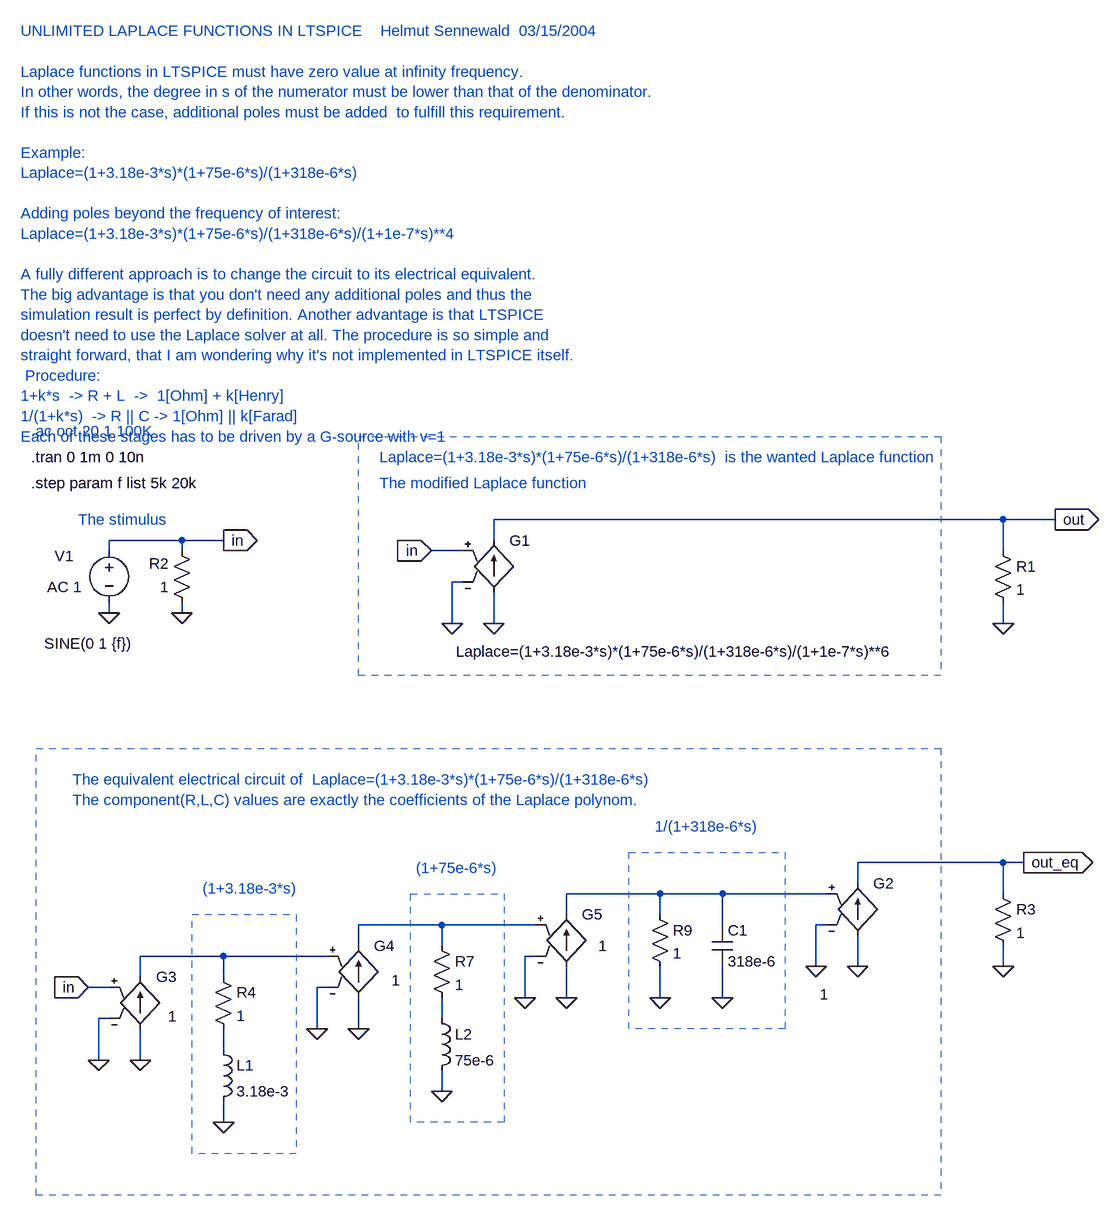
[diagram p0: schematic Laplace_unlimited.asc]
Laplace_unlimited.asc, the LTspice schematic file:
Version 4
SHEET 1 1692 1172
WIRE 448 128 448 160
WIRE 448 240 448 288
WIRE 400 224 384 224
WIRE 448 128 1232 128
WIRE 1232 128 1232 176
WIRE 384 224 384 288
WIRE 1232 256 1232 288
WIRE -32 256 -32 272
WIRE -144 256 -144 272
WIRE -144 160 -144 176
WIRE 400 176 352 176
WIRE -96 800 -96 832
WIRE -96 912 -96 960
WIRE -144 896 -160 896
WIRE -96 800 32 800
WIRE -160 896 -160 960
WIRE -144 848 -176 848
WIRE 32 832 32 800
WIRE 32 912 32 944
WIRE 32 1024 32 1056
WIRE 240 752 240 784
WIRE 240 864 240 912
WIRE 192 848 176 848
WIRE 240 752 368 752
WIRE 176 848 176 912
WIRE 192 800 32 800
WIRE 368 784 368 752
WIRE 368 864 368 896
WIRE 368 976 368 1008
WIRE 560 704 560 736
WIRE 560 816 560 864
WIRE 512 800 496 800
WIRE 560 704 704 704
WIRE 496 800 496 864
WIRE 512 752 368 752
WIRE 704 736 704 704
WIRE 704 816 704 864
WIRE 704 704 800 704
WIRE 800 704 800 752
WIRE 800 816 800 864
WIRE 1232 128 1312 128
WIRE 800 704 960 704
WIRE 1008 656 1008 688
WIRE 1008 768 1008 816
WIRE 960 752 944 752
WIRE 1008 656 1232 656
WIRE 1232 656 1232 704
WIRE 944 752 944 816
WIRE 1232 784 1232 816
WIRE 1232 656 1264 656
WIRE -32 176 -32 160
WIRE -32 160 -144 160
WIRE -32 160 32 160
FLAG 448 288 0
FLAG 384 288 0
FLAG 1232 288 0
FLAG -32 272 0
FLAG -144 272 0
FLAG 1312 128 out
IOPIN 1312 128 Out
FLAG 352 176 in
IOPIN 352 176 In
FLAG -96 960 0
FLAG -160 960 0
FLAG -176 848 in
IOPIN -176 848 In
FLAG 32 1056 0
FLAG 240 912 0
FLAG 176 912 0
FLAG 368 1008 0
FLAG 560 864 0
FLAG 496 864 0
FLAG 704 864 0
FLAG 800 864 0
FLAG 1008 816 0
FLAG 944 816 0
FLAG 1232 816 0
FLAG 1264 656 out_eq
IOPIN 1264 656 Out
FLAG 32 160 in
IOPIN 32 160 Out
SYMBOL voltage -144 160 R0
WINDOW 0 -84 24 Left 0
WINDOW 3 -100 159 Left 0
WINDOW 123 -95 72 Left 0
WINDOW 39 24 160 Left 0
SYMATTR InstName V1
SYMATTR Value SINE(0 1 {f})
SYMATTR Value2 AC 1
SYMBOL res 1216 160 R0
SYMATTR InstName R1
SYMATTR Value 1
SYMBOL res -16 272 R180
WINDOW 0 36 76 Left 0
WINDOW 3 36 40 Left 0
SYMATTR InstName R2
SYMATTR Value 1
SYMBOL g 448 144 R0
WINDOW 3 -58 187 Left 0
SYMATTR Value Laplace=(1+3.18e-3*s)*(1+75e-6*s)/(1+318e-6*s)/(1+1e-7*s)**6
SYMATTR InstName G1
SYMBOL g -96 816 R0
WINDOW 3 43 77 Left 0
SYMATTR Value 1
SYMATTR InstName G3
SYMBOL res 16 816 R0
SYMATTR InstName R4
SYMATTR Value 1
SYMBOL ind 16 928 R0
SYMATTR InstName L1
SYMATTR Value 3.18e-3
SYMBOL g 240 768 R0
WINDOW 3 51 69 Left 0
SYMATTR Value 1
SYMATTR InstName G4
SYMBOL res 352 768 R0
SYMATTR InstName R7
SYMATTR Value 1
SYMBOL ind 352 880 R0
SYMATTR InstName L2
SYMATTR Value 75e-6
SYMBOL g 560 720 R0
WINDOW 3 49 64 Left 0
SYMATTR Value 1
SYMATTR InstName G5
SYMBOL res 688 720 R0
SYMATTR InstName R9
SYMATTR Value 1
SYMBOL cap 784 752 R0
SYMATTR InstName C1
SYMATTR Value 318e-6
SYMBOL res 1216 688 R0
SYMATTR InstName R3
SYMATTR Value 1
SYMBOL g 1008 672 R0
WINDOW 3 -58 187 Left 0
SYMATTR Value 1
SYMATTR InstName G2
TEXT -264 -8 Left 0 ;.ac oct 20 1 100K
TEXT -264 32 Left 0 !.tran 0 1m 0 10n
TEXT -264 72 Left 0 !.step param f list 5k 20k
TEXT 272 32 Left 0 ;Laplace=(1+3.18e-3*s)*(1+75e-6*s)/(1+318e-6*s)  is the wanted Laplace function
TEXT -280 -624 Left 0 ;UNLIMITED LAPLACE FUNCTIONS IN LTSPICE    Helmut Sennewald  03/15/2004\n \nLaplace functions in LTSPICE must have zero value at infinity frequency.\nIn other words, the degree in s of the numerator must be lower than that of the denominator.\nIf this is not the case, additional poles must be added  to fulfill this requirement.\n \nExample:\nLaplace=(1+3.18e-3*s)*(1+75e-6*s)/(1+318e-6*s)\n \nAdding poles beyond the frequency of interest:\nLaplace=(1+3.18e-3*s)*(1+75e-6*s)/(1+318e-6*s)/(1+1e-7*s)**4\n \nA fully different approach is to change the circuit to its electrical equivalent.\nThe big advantage is that you don't need any additional poles and thus the\nsimulation result is perfect by definition. Another advantage is that LTSPICE\ndoesn't need to use the Laplace solver at all. The procedure is so simple and\nstraight forward, that I am wondering why it's not implemented in LTSPICE itself.\n Procedure:\n1+k*s  -> R + L  ->  1[Ohm] + k[Henry]\n1/(1+k*s)  -> R || C -> 1[Ohm] || k[Farad]\nEach of these stages has to be driven by a G-source with v=1
TEXT 0 696 Left 0 ;(1+3.18e-3*s)
TEXT 328 664 Left 0 ;(1+75e-6*s)
TEXT 696 600 Left 0 ;1/(1+318e-6*s)
TEXT -200 528 Left 0 ;The equivalent electrical circuit of  Laplace=(1+3.18e-3*s)*(1+75e-6*s)/(1+318e-6*s) \nThe component(R,L,C) values are exactly the coefficients of the Laplace polynom.
TEXT 272 72 Left 0 ;The modified Laplace function
TEXT -192 128 Left 0 ;The stimulus
RECTANGLE Normal 144 1104 -16 736 2
RECTANGLE Normal 464 1056 320 704 2
RECTANGLE Normal 896 912 656 640 2
RECTANGLE Normal 1136 368 240 0 2
RECTANGLE Normal 1136 1168 -256 480 2

The netlist it stands for:
* Laplace_unlimited.asc
V1 in 0 SINE(0 1 {f}) AC 1
R1 out 0 1
R2 0 in 1
G1 0 out in 0 Laplace=(1+3.18e-3*s)*(1+75e-6*s)/(1+318e-6*s)/(1+1e-7*s)**6
G3 0 N001 in 0 1
R4 N001 N002 1
L1 N002 0 3.18e-3
G4 0 N003 N001 0 1
R7 N003 N004 1
L2 N004 0 75e-6
G5 0 N005 N003 0 1
R9 N005 0 1
C1 N005 0 318e-6
R3 out_eq 0 1
G2 0 out_eq N005 0 1
* .ac oct 20 1 100K
.tran 0 1m 0 10n
.step param f list 5k 20k
* Laplace=(1+3.18e-3*s)*(1+75e-6*s)/(1+318e-6*s)  is the wanted Laplace function
* UNLIMITED LAPLACE FUNCTIONS IN LTSPICE    Helmut Sennewald  03/15/2004
* Laplace functions in LTSPICE must have zero value at infinity frequency.
* In other words, the degree in s of the numerator must be lower than that of the denominator.
* If this is not the case, additional poles must be added  to fulfill this requirement.
* Example:
* Laplace=(1+3.18e-3*s)*(1+75e-6*s)/(1+318e-6*s)
* Adding poles beyond the frequency of interest:
* Laplace=(1+3.18e-3*s)*(1+75e-6*s)/(1+318e-6*s)/(1+1e-7*s)**4
* A fully different approach is to change the circuit to its electrical equivalent.
* The big advantage is that you don't need any additional poles and thus the
* simulation result is perfect by definition. Another advantage is that LTSPICE
* doesn't need to use the Laplace solver at all. The procedure is so simple and
* straight forward, that I am wondering why it's not implemented in LTSPICE itself.
*  Procedure:
* 1+k*s  -> R + L  ->  1[Ohm] + k[Henry]
* 1/(1+k*s)  -> R || C -> 1[Ohm] || k[Farad]
* Each of these stages has to be driven by a G-source with v=1
* (1+3.18e-3*s)
* (1+75e-6*s)
* 1/(1+318e-6*s)
* The equivalent electrical circuit of  Laplace=(1+3.18e-3*s)*(1+75e-6*s)/(1+318e-6*s)
* The component(R,L,C) values are exactly the coefficients of the Laplace polynom.
* The modified Laplace function
* The stimulus
.backanno
.end